# EAGLE design ThumbJoyStick (EAGLE 6.2)
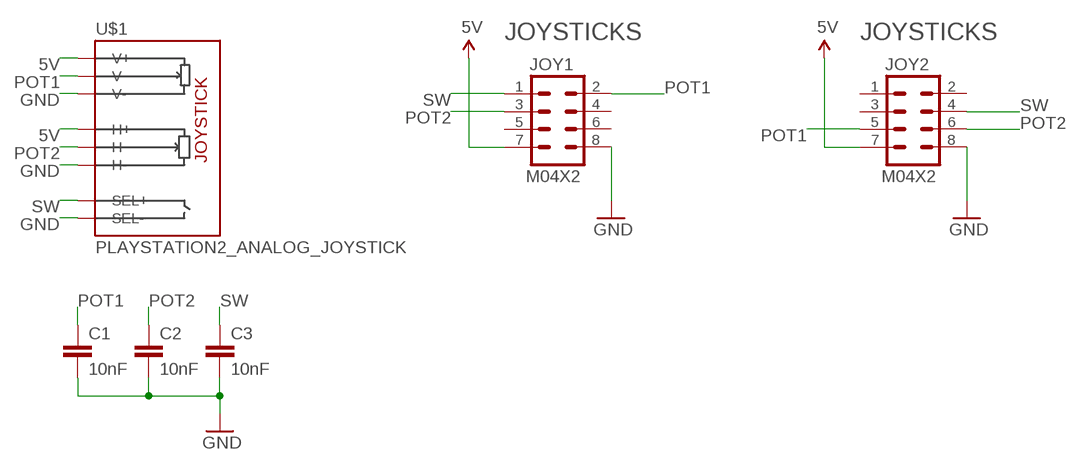
[diagram p0: schematic, sheet 1]

## Parts
C1  10nF  CAP0603-CAP  [0603-CAP]
C2  10nF  CAP0603-CAP  [0603-CAP]
C3  10nF  CAP0603-CAP  [0603-CAP]
JOY1  M04X2  [2X4]
JOY2  M04X2  [2X4]
U$1  PLAYSTATION2_ANALOG_JOYSTICK  [PLAYSTATION2_ANALOG_JOYSTICK]

## Nets
5V: JOY1.7 JOY2.7 U$1.H1(H+) U$1.V1(V+)
GND: C1.2 C2.2 C3.2 JOY1.8 JOY2.8 U$1.B2A(SEL-) U$1.H3(H-) U$1.V3(V-)
POT1: C1.1 JOY1.2 JOY2.5 U$1.V2(V)
POT2: C2.1 JOY1.3 JOY2.6 U$1.H2(H)
SW: C3.1 JOY1.1 JOY2.4 U$1.B1A(SEL+)
Unconnected: JOY1.4 JOY1.5 JOY1.6 JOY2.1 JOY2.2 JOY2.3

## Notes on the sheet
- JOYSTICKS | JOYSTICKS

## Library data of the parts
C1-C3 = SparkFun:CAP: Capacitor Standard 0603 ceramic capacitor, and 0.1" leaded capacitor.
JOY1 JOY2 = SparkFun:M04X2
U$1 = SKAARHOJ:PLAYSTATION2_ANALOG_JOYSTICK: Playstation2 Analog Joystick with a Switch

## Net classes
0 default: width 0.203 mm, drill 0.406 mm, clearance 0.203 mm

## Board
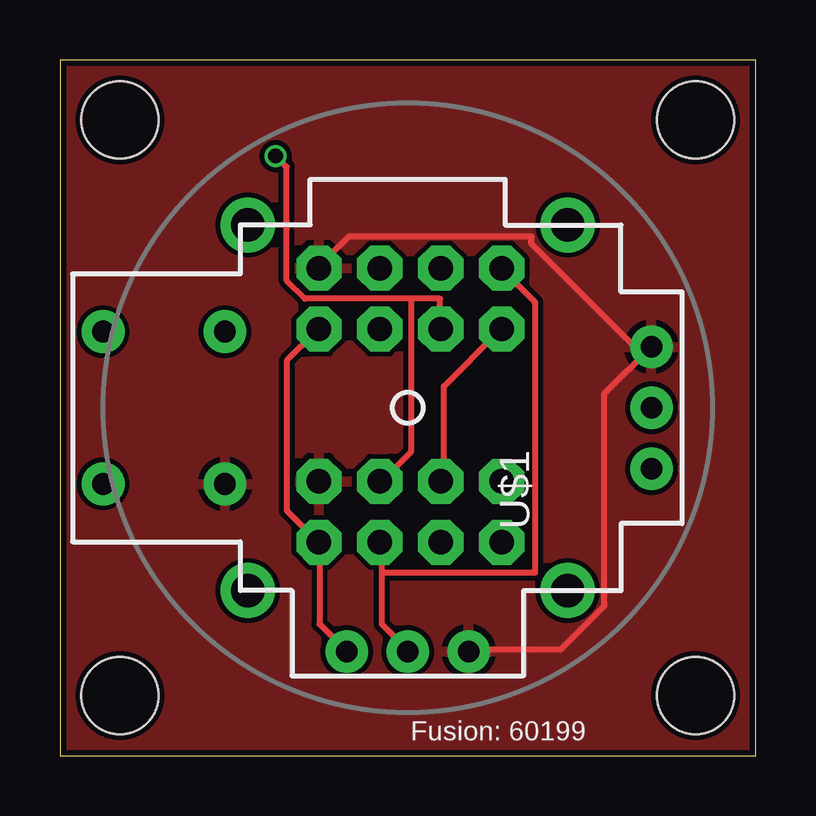
[diagram p1: board, top side]
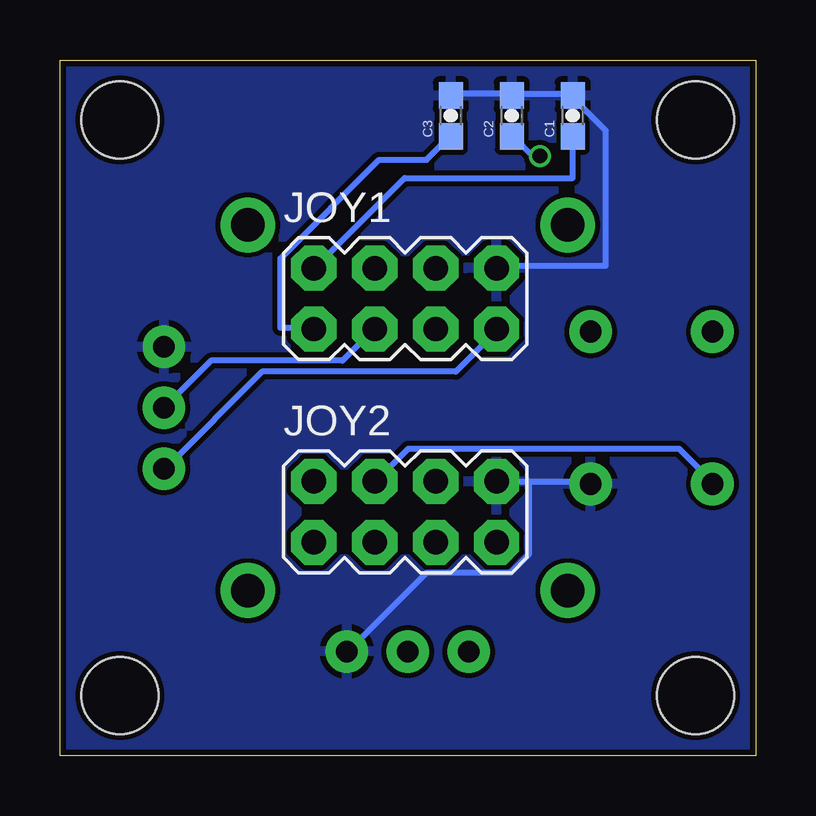
[diagram p2: board, bottom side, seen from below]

Size 29 x 29 mm. Coordinates in mm from the lower left corner, seen from the top.
Outline: 0,0 29,0 29,29 0,29 0,0
Copper layers (1*16): Top 0.035mm / dielectric 1.5mm / Bottom 0.035mm
Design rules: minimum track width 6mil, minimum drill 12mil, track to track 6mil, track to pad 6mil, pad to pad 6mil, via to via 6mil, smd to smd 0mil, copper to edge 10mil, drill to drill 10mil, minimum pad ring 10mil, minimum via ring 6mil, stop-mask expansion 2mil, vias tented up to drill 100mil, thermal gap 10mil
Holes 3.2 mm at 2.5,26.5 26.5,26.5 26.5,2.5 2.5,2.5

### Footprints (pad centres in the part's own frame; a part is rotated, then mirrored left to right if it is on the bottom)
0603-CAP = smd 1.1 x 1: 1 -0.85,0; 2 0.85,0
2X4 = drill 1.016 pad 1.88 octagon: 1 -3.81,-1.27; 2 -3.81,1.27; 3 -1.27,-1.27; 4 -1.27,1.27; 5 1.27,-1.27; 6 1.27,1.27; 7 3.81,-1.27; 8 3.81,1.27
PLAYSTATION2_ANALOG_JOYSTICK = drill 0.9 pad 1.778: B1A -3.175,12.7; B1B 3.175,12.7; B2A -3.175,7.62; B2B 3.175,7.62 | drill 0.889 pad 1.778: H1 -2.54,-10.16; H2 0,-10.16; H3 2.54,-10.16; V1 -10.16,2.54; V2 -10.16,0; V3 -10.16,-2.54 | drill 1.397 pad 2.286: MOUNT1 -7.62,6.668; MOUNT2 -7.62,-6.668; MOUNT3 7.62,-6.668; MOUNT4 7.62,6.668

### Placement (x,y rotation side)
C1  7.62,26.67 90 bottom
C2  10.16,26.67 90 bottom
C3  12.7,26.67 90 bottom
JOY1  14.61,19.05 0 bottom
JOY2  14.61,10.16 0 bottom
U$1  14.5,14.5 90 top

### Tracks (layer width: path | path; a pad name or v marks a point on that pad's centre or on a via)
5V
  Top 0.254: U$1.V1 11.89,4.42 10.82,5.49 10.82,8.84 JOY2.7 10.67,8.99 9.45,10.21 9.45,16.46 10.67,17.68 JOY1.7
  Bottom 0.254: U$1.H1 24.54,12.04 20.57,16 12.5,16 10.82,17.68 JOY1.7
GND
  Top 0.254: U$1.V3 17.07,4.42 20.88,4.42 22.71,6.25 22.71,15.09 U$1.H3 24.23,16.76 19.66,21.34 19.66,21.64 12.04,21.64 10.82,20.42 JOY1.8
  Bottom 0.254: C3.2 12.65,27.58 10.21,27.58 C2.2 10.06,27.58 7.62,27.58 C1.2 7.62,27.43 6.25,26.06 6.25,20.42 10.67,20.42 JOY1.8 | JOY2.8 9.45,11.43 | 9.45,11.43 7.01,11.43 U$1.B2A | 9.45,11.43 9.45,8.38 10.21,7.62 13.72,7.62 16.92,4.42 U$1.V3
  pour Top: 0,0 0,29.21 29.21,29.21 29.21,0
  pour Bottom: 0,0 0,29.21 29.21,29.21 29.21,0
POT1
  Top 0.254: 13.41,7.62 13.41,8.84 JOY2.5 | 13.41,7.62 13.41,5.49 14.48,4.42 U$1.V2 | 13.41,7.62 19.81,7.62 19.81,18.9 18.44,20.27 JOY1.2
  Bottom 0.254: C1.1 7.62,24.08 14.63,24.08 18.29,20.42 JOY1.2
POT2  (via drill 0.61)
  Top 0.254: v8.99,24.99 9.45,24.54 9.45,19.81 10.21,19.05 14.63,19.05 | 14.63,19.05 15.85,19.05 15.85,17.83 JOY1.3 | 14.63,19.05 14.63,12.65 13.41,11.43 JOY2.6
  Bottom 0.254: v8.99,24.99 9.3,24.99 10.06,25.76 C2.1 | U$1.H2 24.54,14.63 22.71,16.46 17.22,16.46 16,17.68 JOY1.3
SW
  Top 0.254: JOY1.1 18.29,17.68 16,15.39 16,11.43 JOY2.4
  Bottom 0.254: C3.1 12.8,25.76 13.72,24.84 15.7,24.84 19.81,20.73 19.81,17.83 18.44,17.83 JOY1.1 | U$1.B1A 1.83,11.43 3.2,12.8 14.48,12.8 15.85,11.43 JOY2.4

### Text on the board
_tsilk: Fusion: 60199